# Altium schematic sheet Page11 PMIC PCA9450B.SchDoc
size 568 x 386 mm; SheetNumber: 12; SheetTotal: 13
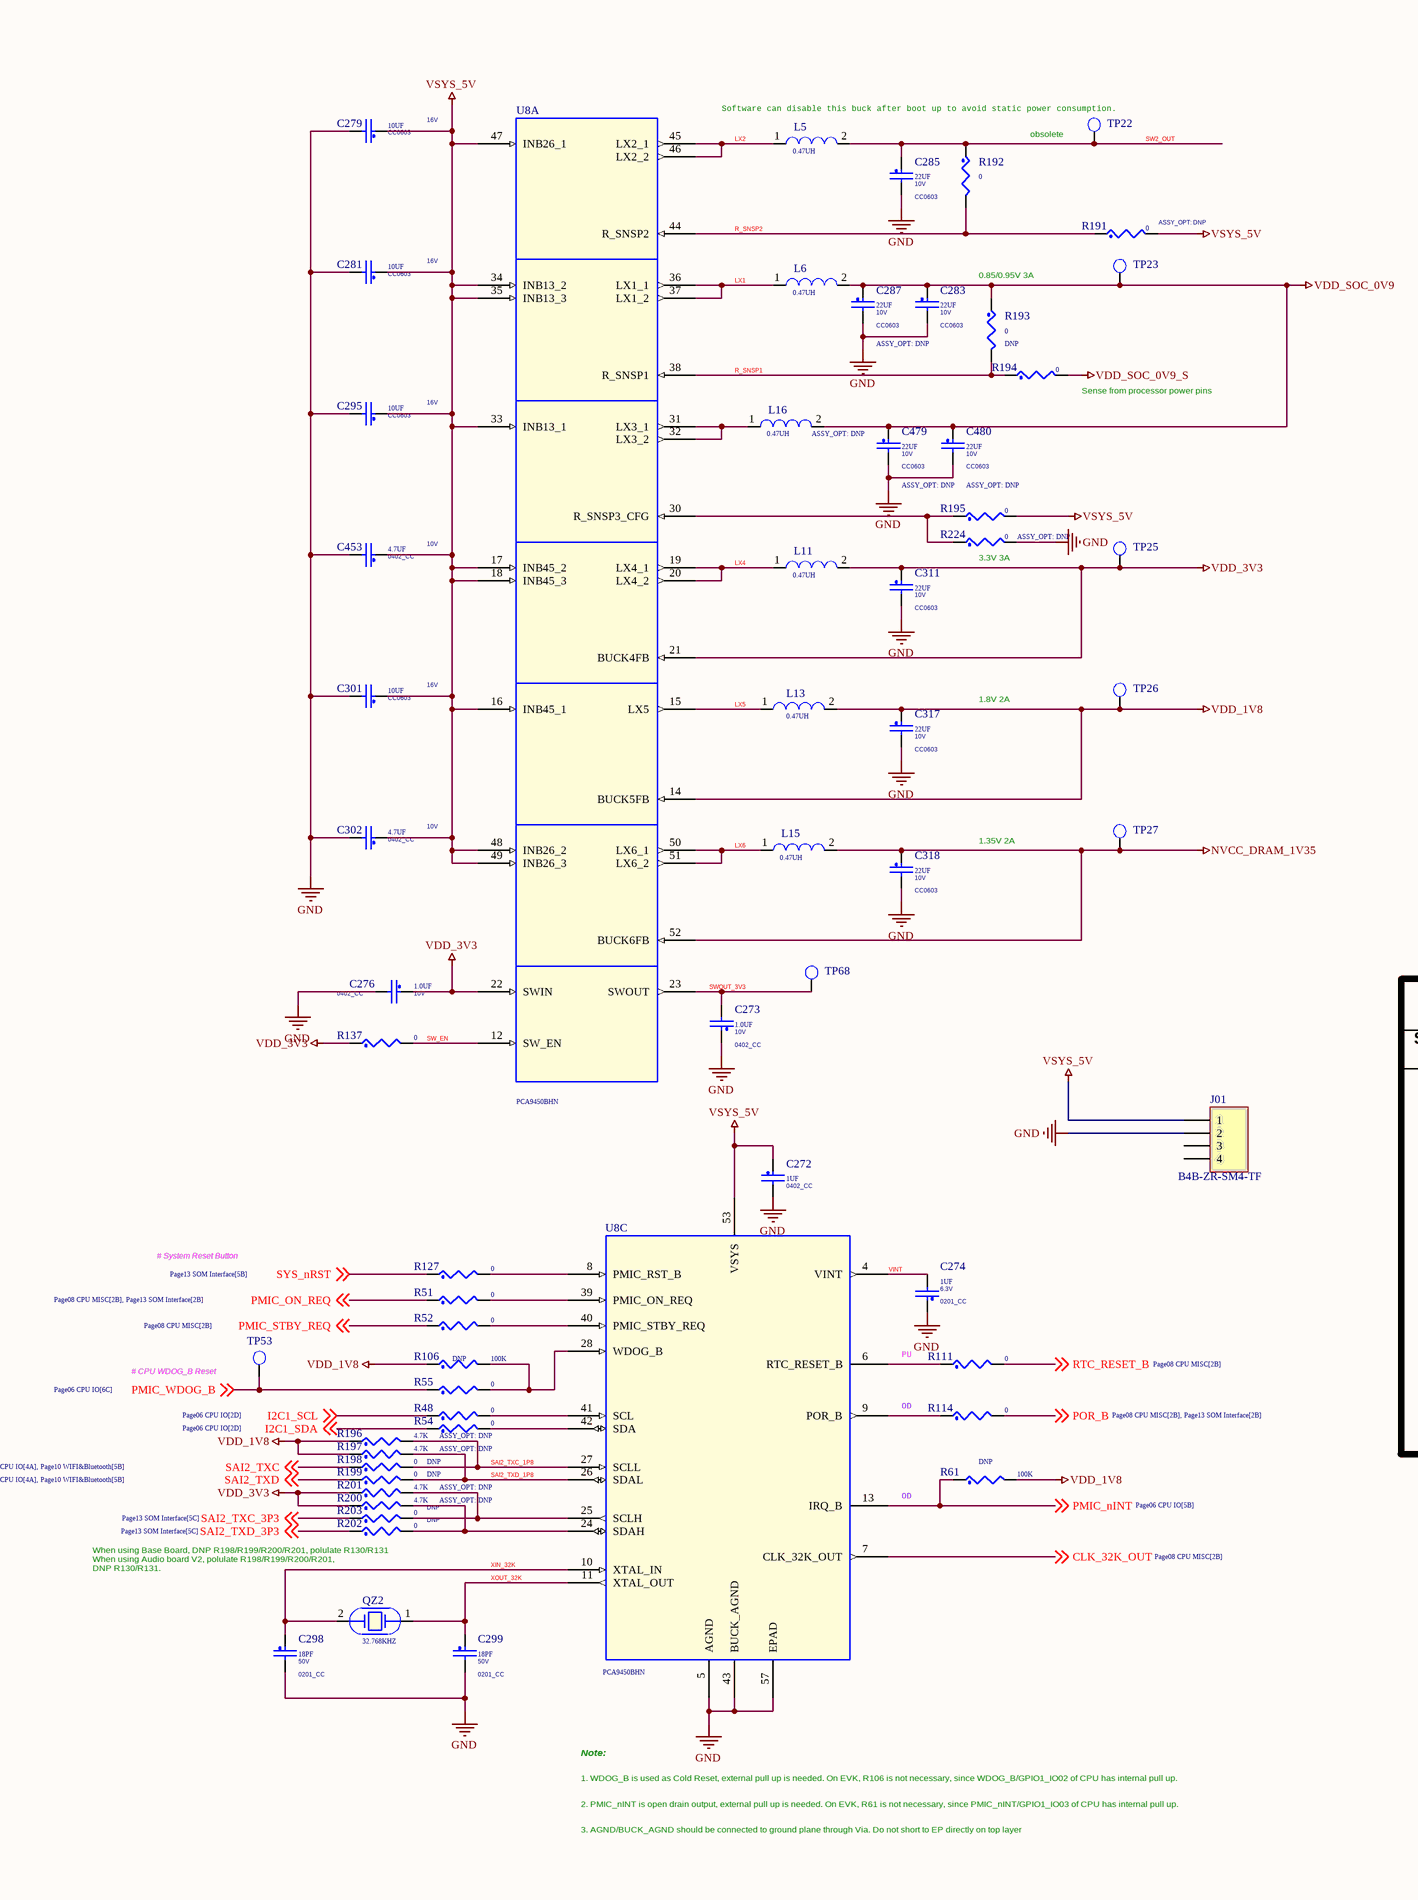
[diagram p0: Page11 PMIC PCA9450B.SchDoc, left]
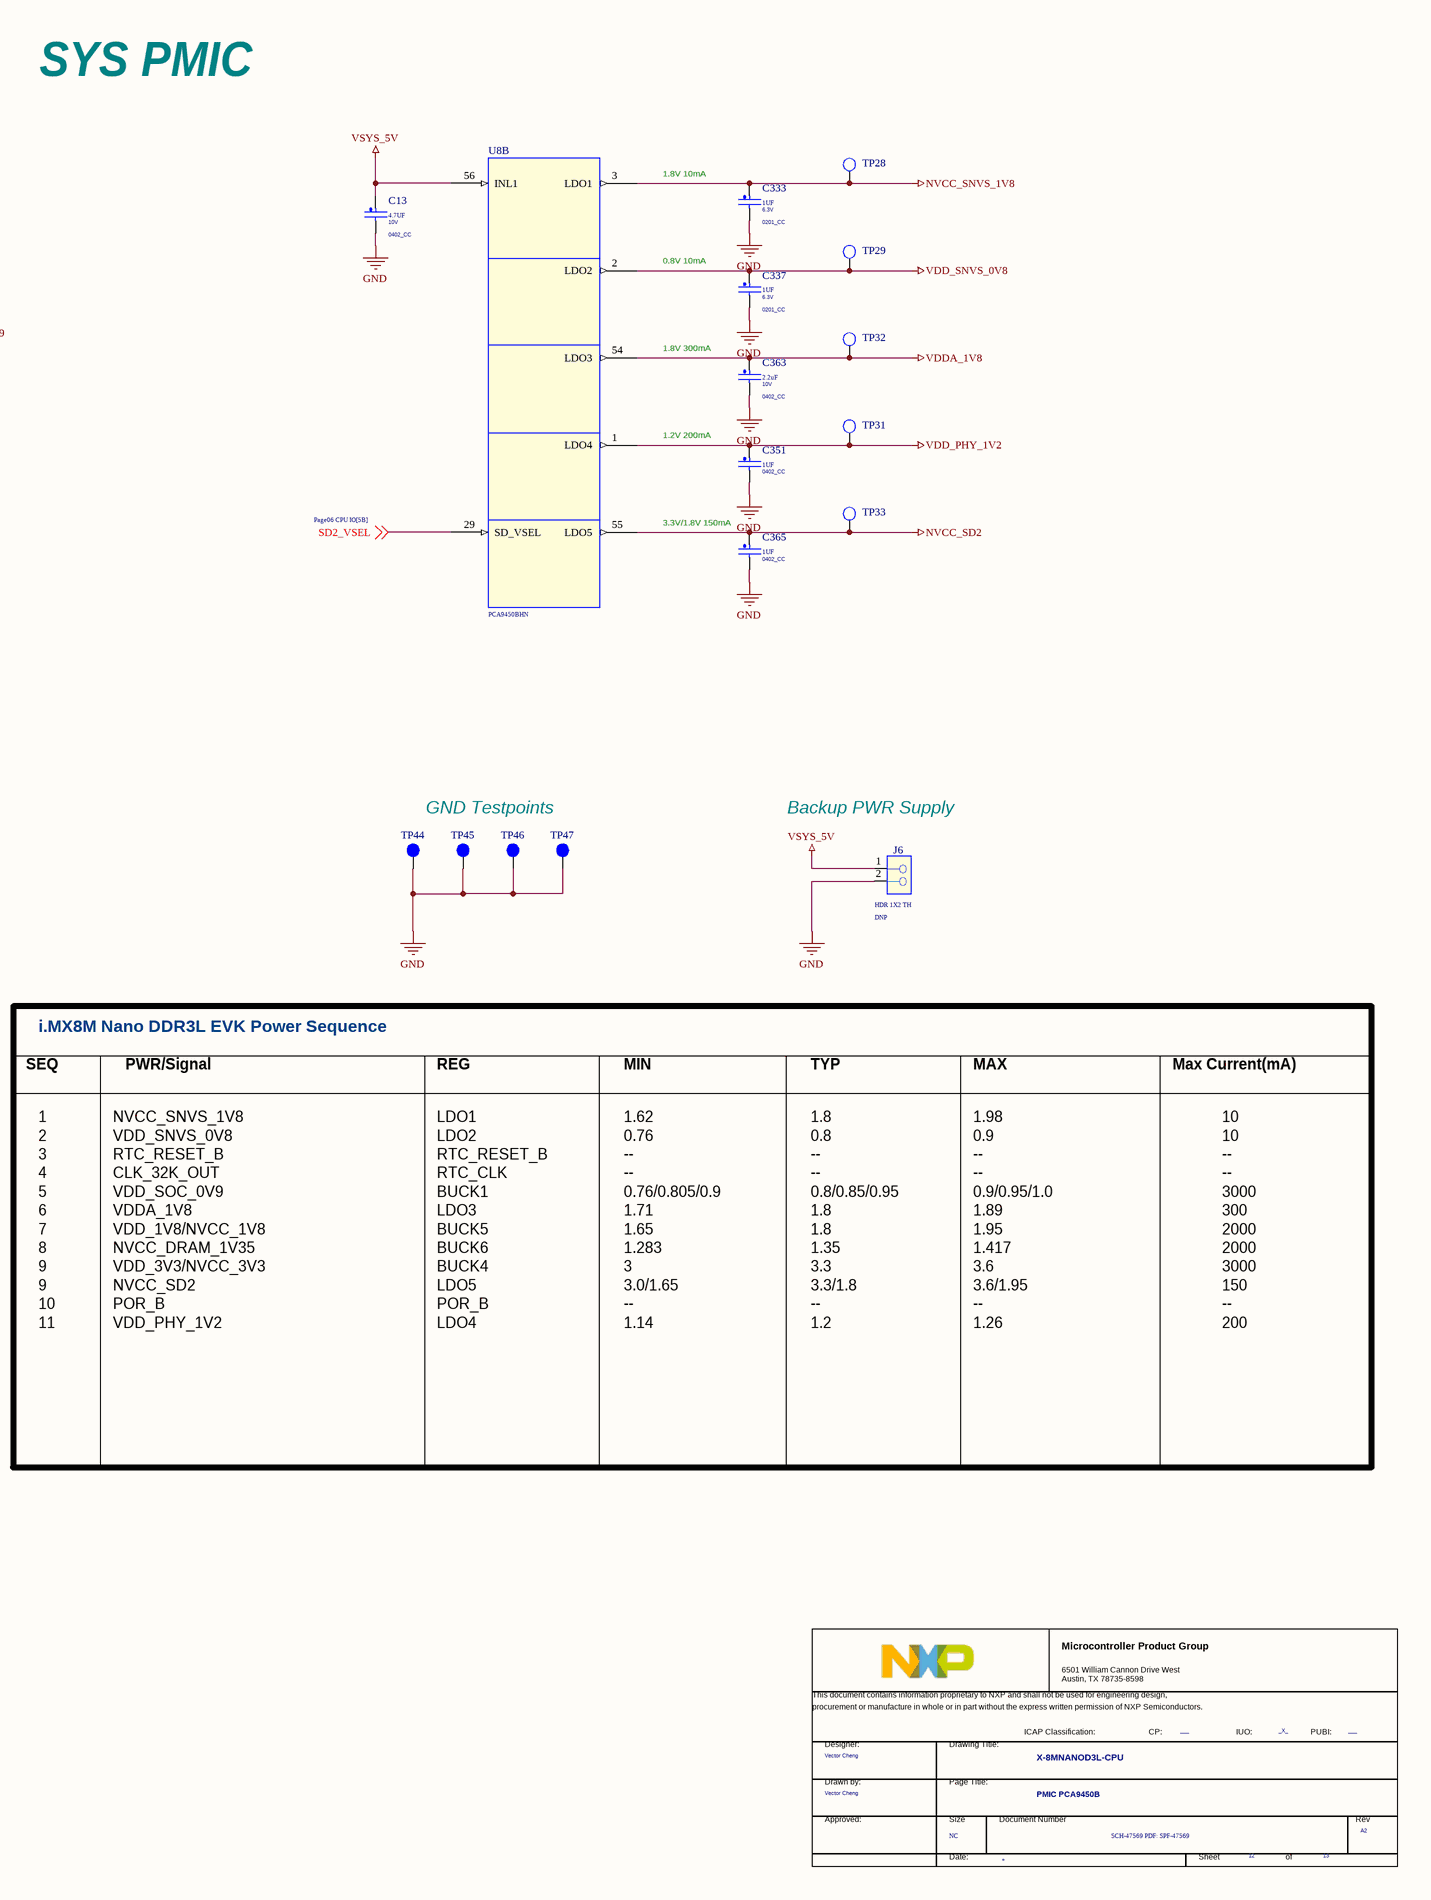
[diagram p1: Page11 PMIC PCA9450B.SchDoc, right]

## Parts
*  FCP: ___  FIUO: _X_  DrawnBy: Vector Cheng  PageTitle: PMIC PCA9450B  Page Count: 13  Page Number: 12  Page Size: NC  Title: X-8MNANOD3L-CPU  RevCode: A2  Doc: SCH-47569 PDF: SPF-47569  (hidden comment: TitleBlock_MCPG)  (graphical)
C13  4.7UF  VOLTAGE: 10V  PCB Footprint: 0402_CC  [0402_CC - C]
C272  1UF  PCB Footprint: 0402_CC  [0402_CC - C]
C273  1.0UF  PCB Footprint: 0402_CC  VOLTAGE: 10V  [0402_CC - C]
C274  1UF  VOLTAGE: 6.3V  PCB Footprint: 0201_CC  [0201_CC - C]
C276  1.0UF  PCB Footprint: 0402_CC  VOLTAGE: 10V  [0402_CC - C]
C279  10UF  VOLTAGE: 16V  PCB Footprint: CC0603  [0603_CC]
C281  10UF  VOLTAGE: 16V  PCB Footprint: CC0603  [0603_CC]
C283  22UF  VOLTAGE: 10V  PCB Footprint: CC0603  [0603_CC]
C285  22UF  PCB Footprint: CC0603  VOLTAGE: 10V  [0603_CC]
C287  22UF  ASSY_OPT: DNP  VOLTAGE: 10V  PCB Footprint: CC0603  [0603_CC]
C295  10UF  VOLTAGE: 16V  PCB Footprint: CC0603  [0603_CC]
C298  18PF  VOLTAGE: 50V  PCB Footprint: 0201_CC  [0201_CC - C]
C299  18PF  VOLTAGE: 50V  PCB Footprint: 0201_CC  [0201_CC - C]
C301  10UF  VOLTAGE: 16V  PCB Footprint: CC0603  [0603_CC]
C302  4.7UF  PCB Footprint: 0402_CC  VOLTAGE: 10V  [0402_CC - C]
C311  22UF  VOLTAGE: 10V  PCB Footprint: CC0603  [0603_CC]
C317  22UF  VOLTAGE: 10V  PCB Footprint: CC0603  [0603_CC]
C318  22UF  VOLTAGE: 10V  PCB Footprint: CC0603  [0603_CC]
C333  1UF  VOLTAGE: 6.3V  PCB Footprint: 0201_CC  [0201_CC - C]
C337  1UF  VOLTAGE: 6.3V  PCB Footprint: 0201_CC  [0201_CC - C]
C351  1UF  PCB Footprint: 0402_CC  [0402_CC - C]
C363  2.2uF  VOLTAGE: 10V  PCB Footprint: 0402_CC  [0402_CC - C]
C365  1UF  PCB Footprint: 0402_CC  [0402_CC - C]
C453  4.7UF  PCB Footprint: 0402_CC  VOLTAGE: 10V  [0402_CC - C]
C479  22UF  ASSY_OPT: DNP  VOLTAGE: 10V  PCB Footprint: CC0603  [0603_CC]
C480  22UF  ASSY_OPT: DNP  VOLTAGE: 10V  PCB Footprint: CC0603  [0603_CC]
J01  B4B-ZR-SM4-TF  [JST_B4B-ZR-SM4-TFT(LF)(SN)]
J6  HDR 1X2 TH  ASSY_OPT: DNP  [HDR_1X2]
L5  0.47UH  [ind_sph2520]
L6  0.47UH  [ind_sph2520]
L11  0.47UH  [ind_sph2520]
L13  0.47UH  [IND_SPH2520]
L15  0.47UH  [ind_sph2520]
L16  0.47UH  ASSY_OPT: DNP  [ind_sph2520]
QZ2  32.768KHZ  [XTAL_ABS07-32.768KHZ-T - duplicate]
R48  0  [0402_CC_RES]
R51  0  [0402_CC_RES]
R52  0  [0402_CC_RES]
R54  0  [0402_CC_RES]
R55  0  [0402_CC_RES]
R61  100K  ASSY_OPT: DNP  [0201_RES]
R106  100K  ASSY_OPT: DNP  [0201_RES]
R111  0  [0402_CC_RES]
R114  0  [0402_CC_RES]
R127  0  [0402_CC_RES]
R137  0  [0402_CC_RES]
R191  0  ASSY_OPT: DNP  [0402_CC_RES]
R192  0  [0402_CC_RES]
R193  0  ASSY_OPT: DNP  [0402_CC_RES]
R194  0  [0402_CC_RES]
R195  0  [0402_CC_RES]
R196  4.7K  ASSY_OPT: DNP  [0201_RES]
R197  4.7K  ASSY_OPT: DNP  [0201_RES]
R198  0  ASSY_OPT: DNP  [0402_CC_RES]
R199  0  ASSY_OPT: DNP  [0402_CC_RES]
R200  4.7K  ASSY_OPT: DNP  [0201_RES]
R201  4.7K  ASSY_OPT: DNP  [0201_RES]
R202  0  ASSY_OPT: DNP  [0402_CC_RES]
R203  0  ASSY_OPT: DNP  [0402_CC_RES]
R224  0  ASSY_OPT: DNP  [0402_CC_RES]
TP22  TP_35MIL  [Test Pin]  (value not drawn)  (graphical)
TP23  TP_35MIL  [Test Pin]  (value not drawn)
TP25  TP_35MIL  [Test Pin]  (value not drawn)
TP26  TP_35MIL  [Test Pin]  (value not drawn)
TP27  TP_35MIL  [Test Pin]  (value not drawn)
TP28  TP_35MIL  [Test Pin]  (value not drawn)  (graphical)
TP29  TP_35MIL  [Test Pin]  (value not drawn)  (graphical)
TP31  TP_35MIL  [Test Pin]  (value not drawn)  (graphical)
TP32  TP_35MIL  [Test Pin]  (value not drawn)  (graphical)
TP33  TP_35MIL  [Test Pin]  (value not drawn)  (graphical)
TP44  TPAD_050  [Test Pin]  (value not drawn)  (graphical)
TP45  TPAD_050  [Test Pin]  (value not drawn)  (graphical)
TP46  TPAD_050  [Test Pin]  (value not drawn)  (graphical)
TP47  TPAD_050  [Test Pin]  (value not drawn)  (graphical)
TP53  TP_35MIL  [Test Pin]  (value not drawn)  (graphical)
TP68  TP_35MIL  [Test Pin]  (value not drawn)
U8  PCA9450BHN  [QFN40P700X700X100-57N-D]  (parts A,B,C of 3)

## Nets
GND: C13.2 C272.2 C273.1 C274.1 C276.2 C279.2 C281.2 C283.2 C285.2 C287.2 C295.2 C298.2 C299.2 C301.2 C302.2 C311.2 C317.2 C318.2 C333.2 C337.2 C351.2 C363.2 C365.2 C453.2 C479.2 C480.2 J01.2 J6.2 R224.2 TP44.1(Pin1) TP45.1(Pin1) TP46.1(Pin1) TP47.1(Pin1) U8.5(AGND) U8.43(BUCK_AGND) U8.57(EPAD)
NVCC_DRAM_1V35: C318.1 L15.2 TP27.1(TP) U8.52(BUCK6FB)
NVCC_SD2: C365.1 TP33.1(TP) U8.55(LDO5)
NVCC_SNVS_1V8: C333.1 TP28.1(TP) U8.3(LDO1)
VDD_1V8: C317.1 L13.2 R61.2 R106.1 R196.1 R197.1 TP26.1(TP) U8.14(BUCK5FB)
VDD_3V3: C276.1 C311.1 L11.2 R137.1 R200.1 R201.1 TP25.1(TP) U8.21(BUCK4FB) U8.22(SWIN)
VDD_PHY_1V2: C351.1 TP31.1(TP) U8.1(LDO4)
VDD_SNVS_0V8: C337.1 TP29.1(TP) U8.2(LDO2)
VDD_SOC_0V9: C283.1 C287.1 C479.1 C480.1 L6.2 L16.2 R193.1 TP23.1(TP)
VDD_SOC_0V9_S: R194.2
VDDA_1V8: C363.1 TP32.1(TP) U8.54(LDO3)
VSYS_5V: C13.1 C272.1 C279.1 C281.1 C295.1 C301.1 C302.1 C453.1 J01.1 J6.1 R191.2 R195.2 U8.16(INB45_1) U8.17(INB45_2) U8.18(INB45_3) U8.33(INB13_1) U8.34(INB13_2) U8.35(INB13_3) U8.47(INB26_1) U8.48(INB26_2) U8.49(INB26_3) U8.53(VSYS) U8.56(INL1)
CLK_32K_OUT: U8.7(CLK_32K_OUT) ; off-sheet CLK_32K_OUT
I2C1_SCL: R48.1 ; off-sheet I2C1_SCL
I2C1_SDA: R54.1 ; off-sheet I2C1_SDA
LX1: L6.1 U8.36(LX1_1) U8.37(LX1_2)
LX2: L5.1 U8.45(LX2_1) U8.46(LX2_2)
LX4: L11.1 U8.19(LX4_1) U8.20(LX4_2)
LX5: L13.1 U8.15(LX5)
LX6: L15.1 U8.50(LX6_1) U8.51(LX6_2)
PMIC_nINT: R61.1 U8.13(IRQ_B) ; off-sheet PMIC_nINT
PMIC_ON_REQ: R51.1 ; off-sheet PMIC_ON_REQ
PMIC_STBY_REQ: R52.1 ; off-sheet PMIC_STBY_REQ
PMIC_WDOG_B: R55.1 TP53.1(TP) ; off-sheet PMIC_WDOG_B
POR_B: R114.2 ; off-sheet POR_B
R_SNSP1: R193.2 R194.1 U8.38(R_SNSP1)
R_SNSP2: R191.1 R192.2 U8.44(R_SNSP2)
RTC_RESET_B: R111.2 ; off-sheet RTC_RESET_B
SAI2_TXC: R198.1 ; off-sheet SAI2_TXC
SAI2_TXC_1P8: R196.2 R198.2 U8.27(SCLL)
SAI2_TXC_3P3: R203.1 ; off-sheet SAI2_TXC_3P3
SAI2_TXD: R199.1 ; off-sheet SAI2_TXD
SAI2_TXD_1P8: R197.2 R199.2 U8.26(SDAL)
SAI2_TXD_3P3: R202.1 ; off-sheet SAI2_TXD_3P3
SD2_VSEL: U8.29(SD_VSEL) ; off-sheet SD2_VSEL
SW2_OUT: C285.1 L5.2 R192.1 TP22.1(TP)
SW_EN: R137.2 U8.12(SW_EN)
SWOUT_3V3: C273.2 TP68.1(TP) U8.23(SWOUT)
SYS_nRST: R127.1 ; off-sheet SYS_nRST
VINT: C274.2 U8.4(VINT)
XIN_32K: C298.1 QZ2.2 U8.10(XTAL_IN)
XOUT_32K: C299.1 QZ2.1 U8.11(XTAL_OUT)
NetL16_1: L16.1 U8.31(LX3_1) U8.32(LX3_2)
NetR48_2: R48.2 U8.41(SCL)
NetR51_2: R51.2 U8.39(PMIC_ON_REQ)
NetR52_2: R52.2 U8.40(PMIC_STBY_REQ)
NetR54_2: R54.2 U8.42(SDA)
NetR55_2: R55.2 R106.2 U8.28(WDOG_B)
NetR111_1: R111.1 U8.6(RTC_RESET_B)
NetR114_1: R114.1 U8.9(POR_B)
NetR127_2: R127.2 U8.8(PMIC_RST_B)
NetR195_1: R195.1 R224.1 U8.30(R_SNSP3_CFG)
NetR200_2: R200.2 R202.2 U8.24(SDAH)
NetR201_2: R201.2 R203.2 U8.25(SCLH)

Not connected (* = marked no-connect by the designer): J01 3 4

## Notes on the sheet
- SYS PMIC
- Software can disable this buck after boot up to avoid static power consumption.
- (near TP22) obsolete
- 1.8V 10mA
- 0.8V 10mA
- (near R193) 0.85/0.95V 3A
- 1.8V 300mA
- (near R194) Sense from processor power pins
- 1.2V 200mA
- (near C365) 3.3V/1.8V 150mA
- (near R224) 3.3V 3A
- 1.8V 2A
- GND Testpoints
- Backup PWR Supply
- 1.35V 2A
- i.MX8M Nano DDR3L EVK Power Sequence
- SEQ
- PWR/Signal
- REG
- MIN
- TYP
- MAX
- Max Current(mA)
- # System Reset Button
- # CPU WDOG_B Reset
- PU
- OD
- 1
  2
  3
  4
  5
  6
  7
  8
  9
  9
  10
  11
- NVCC_SNVS_1V8
  VDD_SNVS_0V8
  RTC_RESET_B
  CLK_32K_OUT
  VDD_SOC_0V9
  VDDA_1V8
  VDD_1V8/NVCC_1V8
  NVCC_DRAM_1V35
  VDD_3V3/NVCC_3V3
  NVCC_SD2
  POR_B
  VDD_PHY_1V2
- LDO1
  LDO2
  RTC_RESET_B
  RTC_CLK
  BUCK1
  LDO3
  BUCK5
  BUCK6
  BUCK4
  LDO5
  POR_B
  LDO4
- 1.62
  0.76
  --
  --
  0.76/0.805/0.9
  1.71
  1.65
  1.283
  3
  3.0/1.65
  --
  1.14
- 1.8
  0.8
  --
  --
  0.8/0.85/0.95
  1.8
  1.8
  1.35
  3.3
  3.3/1.8
  --
  1.2
- 1.98
  0.9
  --
  --
  0.9/0.95/1.0
  1.89
  1.95
  1.417
  3.6
  3.6/1.95
  --
  1.26
- 10
  10
  --
  --
  3000
  300
  2000
  2000
  3000
  150
  --
  200
- When using Base Board, DNP R198/R199/R200/R201, polulate R130/R131
  When using Audio board V2, polulate R198/R199/R200/R201,
  DNP R130/R131.
- Note:
- 1. WDOG_B is used as Cold Reset, external pull up is needed. On EVK, R106 is not necessary, since WDOG_B/GPIO1_IO02 of CPU has internal pull up.
- 2. PMIC_nINT is open drain output, external pull up is needed. On EVK, R61 is not necessary, since PMIC_nINT/GPIO1_IO03 of CPU has internal pull up.
- 3. AGND/BUCK_AGND should be connected to ground plane through Via. Do not short to EP directly on top layer
- (in symbol TitleBlock_MCPG) Microcontroller Product Group; 6501 William Cannon Drive West / Austin, TX 78735-8598; This document contains information proprietary to NXP and shall not be used for engineering design,; procurement or manufacture in whole or in part without the express written permission of NXP Semiconductors.; ICAP Classification:; CP:; IUO:; PUBI:; Designer:; Drawing Title:; Drawn by:; Page Title:; Approved:; Size; Document Number; Rev; Date:; Sheet; of

## Library data of the parts
* = TitleBlock_MCPG: OrgAddr1: NO. 192 Liangjing Rd. Pudong New Area, ShangHai; OrgName: NXP Semiconductor; PUBI: ___; Designer: Vector Cheng; Page Create Date: March  8, 1995; Page Modify Date: *
C13 C453 = CAP_NP: CAP CER 4.7uF 10V 10% X5R 0402; CLASS: DISCRETE; FPLIST: CC0402_25,CC0402_HD,0402_CC; CAD_APPROVED: Yes; MFG_PN01: CL05A475KP5NRNC; MFG_NAME01: Samsung Electro Mechanics; AGILE_PN: 150-80044; HEIGHT: 0.65MM; ROHS: Yes; Tolerance: 10%
C272 C365 = CAP_NP: CAP CER 1uF 10V 10% X7S 0402; CLASS: DISCRETE; VOLTAGE: 10; FPLIST: CC0402_25,CC0402_HD,0402_CC; CAD_APPROVED: Yes; MFG_PN01: GRM155C71A105KE11D; MFG_NAME01: MURATA; AGILE_PN: 150-80357; Temp_Range: -55C - 125C; HEIGHT: 0.6MM; ROHS: Yes; Tolerance: 10%; Package Size: 0402; Temp Range: -55C - 125C
C273 = CAP_NP: CAP CER 1.0UF 10V 10% X5R 0402; CLASS: DISCRETE; FPLIST: CC0402_25,CC0402_HD,0402_CC; CAD_APPROVED: Yes; MFG_PN01: CC0402KRX5R6BB105; MFG_NAME01: YAGEO AMERICA; AGILE_PN: 150-75772; HEIGHT: 0.6MM; ROHS: Yes; Package Size: 0402
C274 = CAP_NP: CAP CER 1uF 6.3V 20% X5R 0201; CLASS: DISCRETE; AGILE_PN: 150-79407; MFG_NAME01: AVX; MFG_PN01: 02016D105MAT2A; CAD_APPROVED: Yes; FPLIST: CC0201,CC0201_HD,0201_CC,0201_CC_012SM_NSP; Tolerance: 20%; ROHS: Yes; HEIGHT: 0.35MM; Package Size: 0201; Package Type: 7¡± reel
C276 = CAP_NP: CAP CER 1.0UF 10V 10% X5R 0402; CLASS: DISCRETE; AGILE_PN: 150-75772; MFG_NAME01: YAGEO AMERICA; MFG_PN01: CC0402KRX5R6BB105; CAD_APPROVED: Yes; FPLIST: CC0402_25,CC0402_HD,0402_CC; ROHS: Yes; HEIGHT: 0.6MM; Package Size: 0402
C279 C281 = CAP_NP: CAP CER 10.0uF 16V 10% X5R 0603; CLASS: DISCRETE; FPLIST: CC0603_OV,CC0603,0603_CC,cc0603_0805_nsp; CAD_APPROVED: Yes; Temp_Range: -55¡ãC to +85¡ãC; MFG_PN01: GRM188R61C106KAALD; MFG_NAME01: MURATA; AGILE_PN: 150-80060; HEIGHT: 0.9MM; ROHS: Yes; Tolerance: 10%; Package Size: 0603; Package Type: SMT; Temp Range: -55¡ãC to +85¡ãC
C283 = CAP_NP: CAP CER 22uF 10V 20% X5R 0603; CLASS: DISCRETE; WVDC: 6.3V; AGILE_PN: 150-79530; MFG_NAME01: TDK; MFG_PN01: C1608X5R1A226M080AC; CAD_APPROVED: Yes; FPLIST: CC0603_OV,CC0603,0603_CC; SIGNAL_MODEL: DEFAULT_CAPACITOR_2.2e+07pF_2_1; Package Size: 0603; Tolerance: 20%; ROHS: Yes; HEIGHT: 1MM
C285 C287 C311 C317 C318 = CAP_NP: CAP CER 22uF 10V 20% X5R 0603; CLASS: DISCRETE; FPLIST: CC0603_OV,CC0603,0603_CC; CAD_APPROVED: Yes; MFG_PN01: C1608X5R1A226M080AC; MFG_NAME01: TDK; AGILE_PN: 150-79530; WVDC: 6.3V; SIGNAL_MODEL: DEFAULT_CAPACITOR_2.2e+07pF_2_1; HEIGHT: 1MM; ROHS: Yes; Tolerance: 20%; Package Size: 0603
C295 C301 = CAP_NP: CAP CER 10.0uF 16V 10% X5R 0603; CLASS: DISCRETE; AGILE_PN: 150-80060; MFG_NAME01: MURATA; MFG_PN01: GRM188R61C106KAALD; Temp_Range: -55¡ãC to +85¡ãC; CAD_APPROVED: Yes; FPLIST: CC0603_OV,CC0603,0603_CC,cc0603_0805_nsp; Tolerance: 10%; ROHS: Yes; HEIGHT: 0.9MM; Package Size: 0603; Package Type: SMT; Temp Range: -55¡ãC to +85¡ãC
C298 = CAP_NP: CAP CER 18pF 50V 5% C0G 0201; CLASS: DISCRETE; FPLIST: CC0201,CC0201_HD,0201_CC; CAD_APPROVED: Yes; MFG_PN01: GRM0335C1H180JA01D; MFG_NAME01: MURATA; AGILE_PN: 150-79476; HEIGHT: 0.33MM; ROHS: Yes; Tolerance: 5%; Package Size: 0201; Package Type: &#966;180mm Paper taping
C299 = CAP_NP: CAP CER 18pF 50V 5% C0G 0201; CLASS: DISCRETE; AGILE_PN: 150-79476; MFG_NAME01: MURATA; MFG_PN01: GRM0335C1H180JA01D; CAD_APPROVED: Yes; FPLIST: CC0201,CC0201_HD,0201_CC; Tolerance: 5%; ROHS: Yes; HEIGHT: 0.33MM; Package Size: 0201; Package Type: &#966;180mm Paper taping
C302 = CAP_NP: CAP CER 4.7uF 10V 10% X5R 0402; CLASS: DISCRETE; AGILE_PN: 150-80044; MFG_NAME01: Samsung Electro Mechanics; MFG_PN01: CL05A475KP5NRNC; CAD_APPROVED: Yes; FPLIST: CC0402_25,CC0402_HD,0402_CC; Tolerance: 10%; ROHS: Yes; HEIGHT: 0.65MM
C333 C337 = CAP_NP: CAP CER 1uF 6.3V 20% X5R 0201; CLASS: DISCRETE; FPLIST: CC0201,CC0201_HD,0201_CC,0201_CC_012SM_NSP; CAD_APPROVED: Yes; MFG_PN01: 02016D105MAT2A; MFG_NAME01: AVX; AGILE_PN: 150-79407; HEIGHT: 0.35MM; ROHS: Yes; Tolerance: 20%; Package Size: 0201; Package Type: 7¡± reel
C351 = CAP_NP: CAP CER 1uF 10V 10% X7S 0402; CLASS: DISCRETE; Temp_Range: -55C - 125C; AGILE_PN: 150-80357; MFG_NAME01: MURATA; MFG_PN01: GRM155C71A105KE11D; CAD_APPROVED: Yes; FPLIST: CC0402_25,CC0402_HD,0402_CC; VOLTAGE: 10; Tolerance: 10%; ROHS: Yes; HEIGHT: 0.6MM; Package Size: 0402; Temp Range: -55C - 125C
C363 = CAP_NP: CAP CER 2.2uF 10V 10% X5R 0402; CLASS: DISCRETE; AGILE_PN: 150-78974; MFG_NAME01: TDK; MFG_PN01: C1005X5R1A225K; CAD_APPROVED: Yes; FPLIST: CC0402_25,CC0402_HD,0402_CC; Tolerance: 10%; ROHS: Yes; HEIGHT: 0.55 MM; Package Size: 0402
C479 = CAP_NP: CAP CER 22uF 10V 20% X5R 0603; CLASS: DISCRETE; SIGNAL_MODEL: DEFAULT_CAPACITOR_2.2e+07pF_2_1; WVDC: 6.3V; AGILE_PN: 150-79530; MFG_NAME01: TDK; MFG_PN01: C1608X5R1A226M080AC; CAD_APPROVED: Yes; FPLIST: CC0603_OV,CC0603,0603_CC; Tolerance: 20%; ROHS: Yes; HEIGHT: 1MM; Package Size: 0603
C480 = CAP_NP: CAP CER 22uF 10V 20% X5R 0603; CLASS: DISCRETE; SIGNAL_MODEL: DEFAULT_CAPACITOR_2.2e+07pF_2_1; FPLIST: CC0603_OV,CC0603,0603_CC; CAD_APPROVED: Yes; MFG_PN01: C1608X5R1A226M080AC; MFG_NAME01: TDK; AGILE_PN: 150-79530; WVDC: 6.3V; HEIGHT: 1MM; ROHS: Yes; Tolerance: 20%; Package Size: 0603
J01 = Header 4: LatestRevisionDate: 17-Jul-2002; LatestRevisionNote: Re-released for DXP Platform.; Publisher: Altium Limited
J6 = CONN_HDR_2X1: HDR 1X2 TH 100MIL SP 339H AU 98L; CLASS: IO; FPLIST: HDR102,SH_HDR102_BOTTOM; CAD_APPROVED: YES; Temp_Range: -55¡ãC to +125¡ãC; MFG_PN01: TSW-102-07-G-S; MFG_NAME01: SAMTEC; AGILE_PN: 210-75439; PCB Footprint: HDR_1X2; HEIGHT: 8.71 MM; ROHS: Yes; Temp Range: -55¡ãC to +125¡ãC
L5 L16 = INDUCTOR: IND PWR 0.47uH@1MHZ 4.7A 20% SMT; PART_TYPE: INDUCTOR\POWER; CLASS: DISCRETE; Temp Range: -40¡ãC to +125¡ãC; CAD_APPROVED: Yes; MFG_PN01: WPN252012ER47MT; MFG_NAME01: SHENZHEN SUNLORD ELECTRONICS CO., LTD; AGILE_PN: 180-78647; PCB Footprint: ind_sph2520; Tolerance: 20%; HEIGHT: 1.2MM; Temp_Range: -40¡ãC to +125¡ãC; ROHS: Yes; TOL: 20%
L6 L15 = INDUCTOR: IND PWR 0.47uH@1MHZ 4.7A 20% SMT; PART_TYPE: INDUCTOR\POWER; CLASS: DISCRETE; AGILE_PN: 180-78647; MFG_NAME01: SHENZHEN SUNLORD ELECTRONICS CO., LTD; MFG_PN01: WPN252012ER47MT; Temp_Range: -40¡ãC to +125¡ãC; CAD_APPROVED: Yes; Tolerance: 20%; TOL: 20%; ROHS: Yes; HEIGHT: 1.2MM; PCB Footprint: ind_sph2520; Temp Range: -40¡ãC to +125¡ãC
L11 = INDUCTOR: IND PWR 0.47uH@1MHZ 4.7A 20% SMT; PART_TYPE: INDUCTOR\POWER; CLASS: DISCRETE; CAD_APPROVED: Yes; Temp_Range: -40¡ãC to +125¡ãC; MFG_PN01: WPN252012ER47MT; MFG_NAME01: SHENZHEN SUNLORD ELECTRONICS CO., LTD; AGILE_PN: 180-78647; HEIGHT: 1.2MM; ROHS: Yes; TOL: 20%; Tolerance: 20%; PCB Footprint: ind_sph2520; Temp Range: -40¡ãC to +125¡ãC
L13 = INDUCTOR: IND WW 0.47uH@1MHz 3.4A 20% 2016; CLASS: DISCRETE; AGILE_PN: 180-78630; MFG_NAME01: MURATA; MFG_PN01: 1286AS-H-R47M=P2; Temp_Range: -40C to +85C; CAD_APPROVED: Yes; PCB Footprint: IND_2016A; VOLTAGE: 20V DC; Tolerance: 20%; ROHS: Yes; HEIGHT: 1.2MM; PART_TYPE: INDUCTOR; Temp Range: -40C to +85C
QZ2 = XTAL: XTAL 32.768KHZ 12.5PF 20PPM 3.2X1.5MM SMT; CLASS: IC; CAD_APPROVED: Yes; MFG_PN01: ABS07-32.768KHZ-T; MFG_NAME01: Abracon Corporation; AGILE_PN: 230-77653; PCB Footprint: XTAL2-3P2X1P5-SM; HEIGHT: 0.9MM; ROHS: Yes
R48 R54 R55 R194 R202 = RES: RES MF ZERO OHM 1/16W 5% 0402; CLASS: DISCRETE; FPLIST: RC0402_25,RC0402_HD,RC0402_X2,0402_CC; CAD_APPROVED: Yes; MFG_PN01: RC0402JR-070RL; MFG_NAME01: YAGEO AMERICA; AGILE_PN: 470-75394; PCB Footprint: 0402_CC; HEIGHT: 0.45 MM; ROHS: Yes; Tolerance: 5%; VOLTAGE: 1/16W
R51 = RES: RES MF ZERO OHM 1/16W 5% 0402; CLASS: DISCRETE; CAD_APPROVED: Yes; MFG_PN01: RC0402JR-070RL; MFG_NAME01: YAGEO AMERICA; AGILE_PN: 470-75394; PCB Footprint: 0402_CC; HEIGHT: 0.45 MM; ROHS: Yes; Tolerance: 5%; VOLTAGE: 1/16W
R52 R127 R193 R195 R203 R224 = RES: RES MF ZERO OHM 1/16W 5% 0402; CLASS: DISCRETE; AGILE_PN: 470-75394; MFG_NAME01: YAGEO AMERICA; MFG_PN01: RC0402JR-070RL; CAD_APPROVED: Yes; FPLIST: RC0402_25,RC0402_HD,RC0402_X2,0402_CC; PCB Footprint: 0402_CC; Tolerance: 5%; ROHS: Yes; HEIGHT: 0.45 MM; VOLTAGE: 1/16W
R61 = RES: RES MF 100K 1/20W 1% 0201; CLASS: DISCRETE; AGILE_PN: 470-77704; MFG_NAME01: SKYMOS; MFG_PN01: RC-0201-104FT; CAD_APPROVED: Yes; FPLIST: RC0201,0201_CC; PCB Footprint: 0201_CC; Tolerance: 1%; ROHS: Yes; HEIGHT: 0.26MM
R106 = RES: RES MF 100K 1/20W 1% 0201; CLASS: DISCRETE; FPLIST: RC0201,0201_CC; CAD_APPROVED: Yes; MFG_PN01: RC-0201-104FT; MFG_NAME01: SKYMOS; AGILE_PN: 470-77704; PCB Footprint: 0201_CC; HEIGHT: 0.26MM; ROHS: Yes; Tolerance: 1%
R111 = RES: RES MF ZERO OHM 1/16W 5% 0402; CLASS: DISCRETE; AGILE_PN: 470-75394; MFG_NAME01: YAGEO AMERICA; MFG_PN01: RC0402JR-070RL; CAD_APPROVED: Yes; TOL: 1%; SIGNAL_MODEL: DEFAULT_RESISTOR_10000OHM_2_1; PCB Footprint: 0402_CC; Tolerance: 5%; ROHS: Yes; HEIGHT: 0.45 MM; VOLTAGE: 1/16W
R114 R137 = RES: RES MF ZERO OHM 1/16W 5% 0402; CLASS: DISCRETE; AGILE_PN: 470-75394; MFG_NAME01: YAGEO AMERICA; MFG_PN01: RC0402JR-070RL; CAD_APPROVED: Yes; PCB Footprint: 0402_CC; Tolerance: 5%; ROHS: Yes; HEIGHT: 0.45 MM; VOLTAGE: 1/16W
R191 R192 R198 R199 = RES: RES MF ZERO OHM 1/16W 5% 0402; CLASS: DISCRETE; PCB Footprint: 0402_CC; FPLIST: RC0402_25,RC0402_HD,RC0402_X2,0402_CC; CAD_APPROVED: Yes; MFG_PN01: RC0402JR-070RL; MFG_NAME01: YAGEO AMERICA; AGILE_PN: 470-75394; HEIGHT: 0.45 MM; ROHS: Yes; Tolerance: 5%; VOLTAGE: 1/16W
R196 R197 R201 = RES: RES MF 4.7K 1/20W 5% AEC-Q200 0201; CLASS: DISCRETE; PCB Footprint: 0201_CC; FPLIST: RC0201,0201_CC; CAD_APPROVED: Yes; Temp_Range: -55C to +155C; MFG_PN01: RK73B1HTTC472J; MFG_NAME01: KOA SPEER; AGILE_PN: 470-79700; HEIGHT: 0.25MM; ROHS: Yes; Tolerance: 5%; Temp Range: -55C to +155C
R200 = RES: RES MF 4.7K 1/20W 5% AEC-Q200 0201; CLASS: DISCRETE; PCB Footprint: 0201_CC; AGILE_PN: 470-79700; MFG_NAME01: KOA SPEER; MFG_PN01: RK73B1HTTC472J; Temp_Range: -55C to +155C; CAD_APPROVED: Yes; FPLIST: RC0201,0201_CC; Tolerance: 5%; ROHS: Yes; HEIGHT: 0.25MM; Temp Range: -55C to +155C
TP22 TP23 TP28 TP29 TP31-TP33 TP53 = T POINT R: TEST POINT PAD .035 SMT, no part to order; ASSY_OPT: DNP; CLASS: IC; AGILE_PN: 510-75618; CAD_APPROVED: Yes; PCB Footprint: testpoint_35mil; ROHS: Yes; HEIGHT: 0.1MM
TP25-TP27 TP68 = T POINT R: TEST POINT PAD .035 SMT, no part to order; ASSY_OPT: DNP; CLASS: IC; CAD_APPROVED: Yes; AGILE_PN: 510-75618; PCB Footprint: testpoint_35mil; HEIGHT: 0.1MM; ROHS: Yes
TP44 TP45 TP47 = TESTLOOP: TEST POINT PAD 50MIL DIA SMT, NO PART TO ORDER; ASSY_OPT: DNP; CLASS: IO; CAD_APPROVED: Yes; MFG_PN01: NOTACOMPONENT; AGILE_PN: 211-76644; PCB Footprint: TPAD_050; HEIGHT: 0.1MM; ROHS: Yes; MFG_NAME01: NOTACOMPONENT
TP46 = TESTLOOP: TEST POINT PAD 50MIL DIA SMT, NO PART TO ORDER; ASSY_OPT: DNP; CLASS: IO; AGILE_PN: 211-76644; MFG_NAME01: NOTACOMPONENT; CAD_APPROVED: Yes; PCB Footprint: TPAD_050; MFG_PN01: NOTACOMPONENT; ROHS: Yes; HEIGHT: 0.1MM
U8 = PCA9450_HVQFN56P_A: IC POWER MANAGEMENT 2.7-5.5V HVQFN56; SPLIT_INST: TRUE; SWAP_INFO: (S1+S2+S3); AGILE_PN: TMP-WF-36197; MFG_NAME01: NXP SEMICONDUCTORS; Temp_Range: -40C to +105C; PRE_APN: 315-82314; CAD_APPROVED: Yes; PCB Footprint: hvqfn56_0p4_7x7_ep4p7mm; CLASS: IC; MFG_PN01: PCA9450BHN; ROHS: Yes; HEIGHT: 1MM; VOLTAGE: 2.7-5.5V; Temp Range: -40C to +105C